# Altium schematic sheet Sheet2_USB-PD.SchDoc: =ProjectName
size A4; DocumentNumber: 2; SheetNumber: 2; SheetTotal: 4
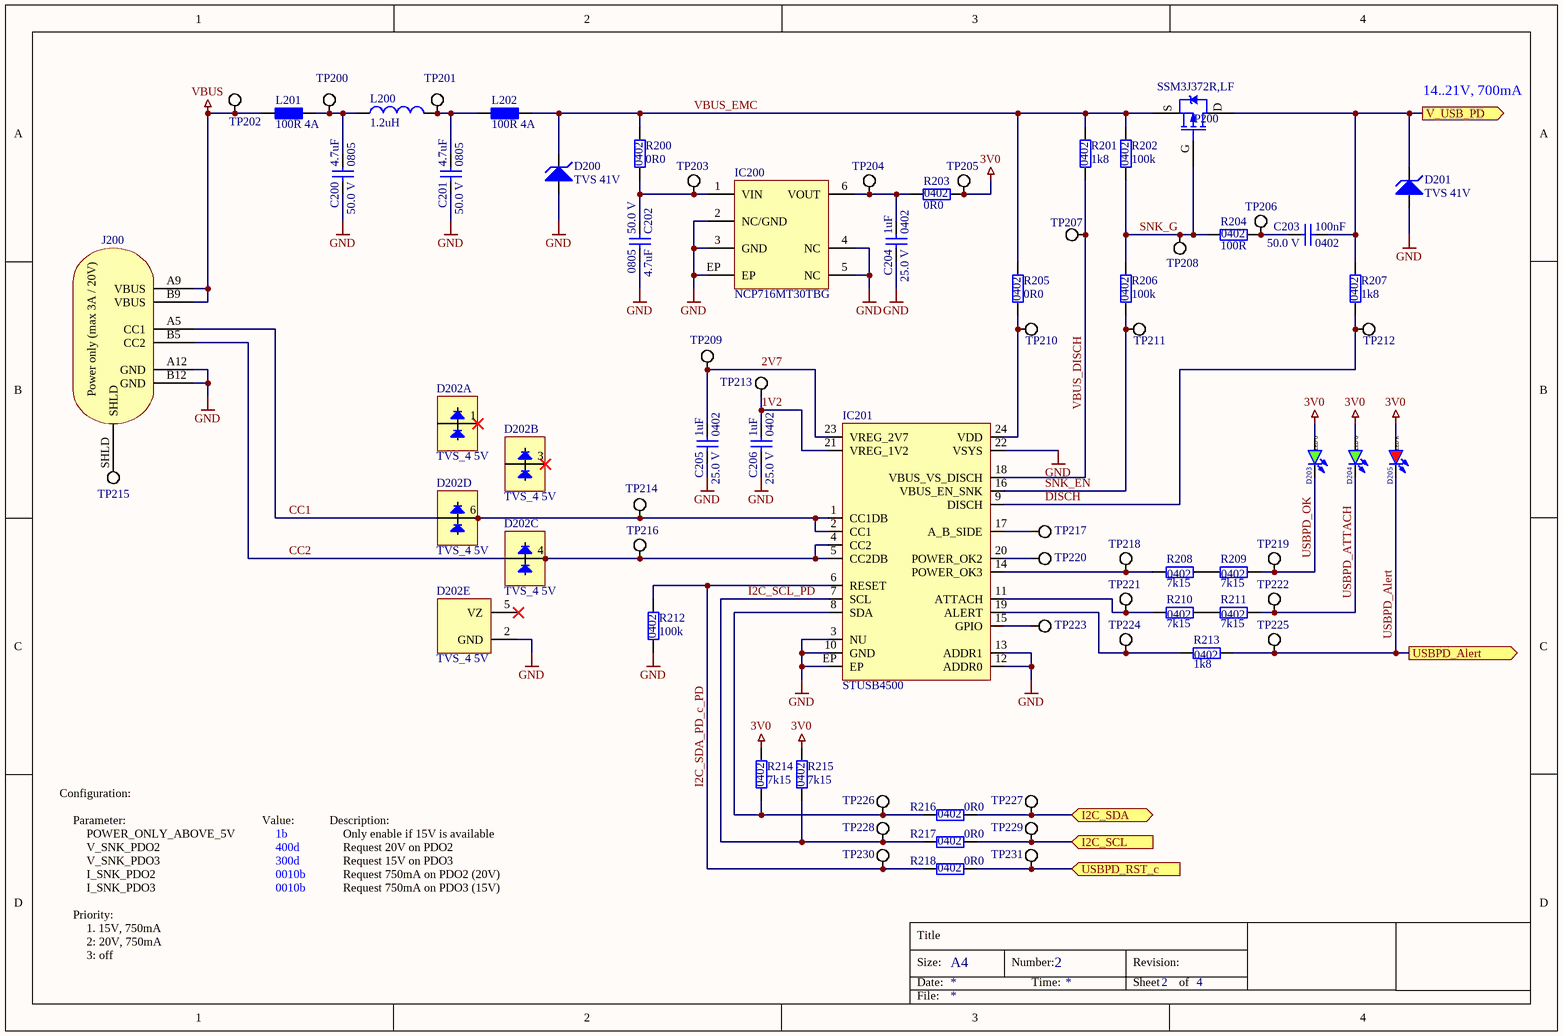
[diagram p0: Sheet2_USB-PD.SchDoc]

## Parts
C200  Capacitance: 4.7uF  Footprint: 0805  Voltage: 50.0 V  [C_0805]  (hidden comment: C 4.7uF 0805 50V)
C201  Capacitance: 4.7uF  Footprint: 0805  Voltage: 50.0 V  [C_0805]  (hidden comment: C 4.7uF 0805 50V)
C202  Capacitance: 4.7uF  Footprint: 0805  Voltage: 50.0 V  [C_0805]  (hidden comment: C 4.7uF 0805 50V)
C203  Capacitance: 100nF  Footprint: 0402  Voltage: 50.0 V  [C_0402]  (hidden comment: C 100nF 0402 50V)
C204  Capacitance: 1uF  Footprint: 0402  Voltage: 25.0 V  [C_0402]  (hidden comment: C 1uF 0402 25V)
C205  Capacitance: 1uF  Footprint: 0402  Voltage: 25.0 V  [C_0402]  (hidden comment: C 1uF 0402 25V)
C206  Capacitance: 1uF  Footprint: 0402  Voltage: 25.0 V  [C_0402]  (hidden comment: C 1uF 0402 25V)
D200  TVS 41V  [UDFN-2]
D201  TVS 41V  [UDFN-2]
D202  TVS_4 5V  [SOT-23-6]  (parts A,B,C,D,E of 5)
D203  LED G  [LED_0603]
D204  LED G  [LED_0603]
D205  LED R  [LED_0603]
IC200  NCP716MT30TBG  [WDFN-6_EP]
IC201  STUSB4500  [VFQFN-24]
J200  USB_C PWR  [J_TYPE-C-3_UJC-HP2-3]  (value not drawn)
L200  Inductance: 1.2uH  [L_3020]  (hidden comment: L 1.2uH 3.9A)
L201  Inductance: 100R 4A  [L_1206]  (hidden comment: L Ferrite 100R 4A)
L202  Inductance: 100R 4A  [L_1206]  (hidden comment: L Ferrite 100R 4A)
P200  Manufacturer Part Number: SSM3J372R,LF  [SOT-23-3-F]  (hidden comment: P PMOS 30V 6A)
R200  Resistance: 0R0  Footprint: 0402  [R_0402]  (hidden comment: R 0R0 0402)
R201  Resistance: 1k8  Footprint: 0402  [R_0402]  (hidden comment: R 1k8 0402)
R202  Resistance: 100k  Footprint: 0402  [R_0402]  (hidden comment: R 100k 0402)
R203  Resistance: 0R0  Footprint: 0402  [R_0402]  (hidden comment: R 0R0 0402)
R204  Resistance: 100R  Footprint: 0402  [R_0402]  (hidden comment: R 100R 0402)
R205  Resistance: 0R0  Footprint: 0402  [R_0402]  (hidden comment: R 0R0 0402)
R206  Resistance: 100k  Footprint: 0402  [R_0402]  (hidden comment: R 100k 0402)
R207  Resistance: 1k8  Footprint: 0402  [R_0402]  (hidden comment: R 1k8 0402)
R208  Resistance: 7k15  Footprint: 0402  [R_0402]  (hidden comment: R 7k15 0402)
R209  Resistance: 7k15  Footprint: 0402  [R_0402]  (hidden comment: R 7k15 0402)
R210  Resistance: 7k15  Footprint: 0402  [R_0402]  (hidden comment: R 7k15 0402)
R211  Resistance: 7k15  Footprint: 0402  [R_0402]  (hidden comment: R 7k15 0402)
R212  Resistance: 100k  Footprint: 0402  [R_0402]  (hidden comment: R 100k 0402)
R213  Resistance: 1k8  Footprint: 0402  [R_0402]  (hidden comment: R 1k8 0402)
R214  Resistance: 7k15  Footprint: 0402  [R_0402]  (hidden comment: R 7k15 0402)
R215  Resistance: 7k15  Footprint: 0402  [R_0402]  (hidden comment: R 7k15 0402)
R216  Resistance: 0R0  Footprint: 0402  [R_0402]  (hidden comment: R 0R0 0402)
R217  Resistance: 0R0  Footprint: 0402  [R_0402]  (hidden comment: R 0R0 0402)
R218  Resistance: 0R0  Footprint: 0402  [R_0402]  (hidden comment: R 0R0 0402)
TP200  TP  [TP_1mm]  (value not drawn)  (net tie, no BOM)
TP201  TP  [TP_1mm]  (value not drawn)  (net tie, no BOM)
TP202  TP  [TP_1mm]  (value not drawn)  (net tie, no BOM)
TP203  TP  [TP_1mm]  (value not drawn)  (net tie, no BOM)
TP204  TP  [TP_1mm]  (value not drawn)  (net tie, no BOM)
TP205  TP  [TP_1mm]  (value not drawn)  (net tie, no BOM)
TP206  TP  [TP_1mm]  (value not drawn)  (net tie, no BOM)
TP207  TP  [TP_1mm]  (value not drawn)  (net tie, no BOM)
TP208  TP  [TP_1mm]  (value not drawn)  (net tie, no BOM)
TP209  TP  [TP_1mm]  (value not drawn)  (net tie, no BOM)
TP210  TP  [TP_1mm]  (value not drawn)  (net tie, no BOM)
TP211  TP  [TP_1mm]  (value not drawn)  (net tie, no BOM)
TP212  TP  [TP_1mm]  (value not drawn)  (net tie, no BOM)
TP213  TP  [TP_1mm]  (value not drawn)  (net tie, no BOM)
TP214  TP  [TP_1mm]  (value not drawn)  (net tie, no BOM)
TP215  TP  [TP_1mm]  (value not drawn)  (net tie, no BOM)
TP216  TP  [TP_1mm]  (value not drawn)  (net tie, no BOM)
TP217  TP  [TP_1mm]  (value not drawn)  (net tie, no BOM)
TP218  TP  [TP_1mm]  (value not drawn)  (net tie, no BOM)
TP219  TP  [TP_1mm]  (value not drawn)  (net tie, no BOM)
TP220  TP  [TP_1mm]  (value not drawn)  (net tie, no BOM)
TP221  TP  [TP_1mm]  (value not drawn)  (net tie, no BOM)
TP222  TP  [TP_1mm]  (value not drawn)  (net tie, no BOM)
TP223  TP  [TP_1mm]  (value not drawn)  (net tie, no BOM)
TP224  TP  [TP_1mm]  (value not drawn)  (net tie, no BOM)
TP225  TP  [TP_1mm]  (value not drawn)  (net tie, no BOM)
TP226  TP  [TP_1mm]  (value not drawn)  (net tie, no BOM)
TP227  TP  [TP_1mm]  (value not drawn)  (net tie, no BOM)
TP228  TP  [TP_1mm]  (value not drawn)  (net tie, no BOM)
TP229  TP  [TP_1mm]  (value not drawn)  (net tie, no BOM)
TP230  TP  [TP_1mm]  (value not drawn)  (net tie, no BOM)
TP231  TP  [TP_1mm]  (value not drawn)  (net tie, no BOM)

## Ports
I2C_SCL (in), I2C_SDA (bidir), USBPD_Alert (out), USBPD_RST_c (in), V_USB_PD (out)

## Nets
3V0: D203.A D204.A D205.A R203.2 R214.2 R215.2 TP205.1(TP)
GND: C200.1 C201.1 C202.2 C204.1 C205.1 C206.1 D200.2(A) D201.2(A) D202.2(GND) IC200.2(NC/GND) IC200.3(GND) IC200.4(NC) IC200.5(NC) IC200.EP IC201.3(NU) IC201.10(GND) IC201.12(ADDR0) IC201.13(ADDR1) IC201.22(VSYS) IC201.EP J200.A12(GND) J200.B12(GND) R212.1
VBUS: J200.A9(VBUS) J200.B9(VBUS) L201.1 TP202.1(TP)
1V2: C206.2 IC201.21(VREG_1V2) TP213.1(TP)
2V7: C205.2 IC201.23(VREG_2V7) TP209.1(TP)
CC1: D202.6 IC201.1(CC1DB) IC201.2(CC1) J200.A5(CC1) TP214.1(TP)
CC2: D202.4 IC201.4(CC2) IC201.5(CC2DB) J200.B5(CC2) TP216.1(TP)
DISCH: IC201.9(DISCH) R207.1 TP212.1(TP)
I2C_SCL: R217.2 TP229.1(TP) ; port I2C_SCL
I2C_SCL_PD: IC201.7(SCL) R215.1 R217.1 TP228.1(TP)
I2C_SDA: R216.2 TP227.1(TP) ; port I2C_SDA
I2C_SDA_PD_c_PD: IC201.6(RESET) R212.2 R218.1 TP230.1(TP)
SNK_EN: IC201.16(VBUS_EN_SNK) R206.1 TP211.1(TP)
SNK_G: P200.1(G) R202.1 R204.1 R206.2 TP208.1(TP)
USBPD_Alert: D205.K R213.1 TP225.1(TP) ; port USBPD_Alert
USBPD_ATTACH: D204.K R211.1 TP222.1(TP)
USBPD_OK: D203.K R209.1 TP219.1(TP)
USBPD_RST_c: R218.2 TP231.1(TP) ; port USBPD_RST_c
V_USB_PD: C203.2 D201.1(K) P200.3(D) R207.2 ; port V_USB_PD
VBUS_DISCH: IC201.18(VBUS_VS_DISCH) R201.1 TP207.1(TP)
VBUS_EMC: D200.1(K) L202.2 P200.2(S) R200.2 R201.2 R202.2 R205.2
NetC200_2: C200.2 L200.1 L201.2 TP200.1(TP)
NetC201_2: C201.2 L200.2 L202.1 TP201.1(TP)
NetC202_1: C202.1 IC200.1(VIN) R200.1 TP203.1(TP)
NetC203_1: C203.1 R204.2 TP206.1(TP)
NetC204_2: C204.2 IC200.6(VOUT) R203.1 TP204.1(TP)
NetIC201_8: IC201.8(SDA) R214.1 R216.1 TP226.1(TP)
NetIC201_11: IC201.11(ATTACH) R210.2 TP221.1(TP)
NetIC201_14: IC201.14(POWER_OK3) R208.2 TP218.1(TP)
NetIC201_15: IC201.15(GPIO) TP223.1(TP)
NetIC201_17: IC201.17(A_B_SIDE) TP217.1(TP)
NetIC201_19: IC201.19(ALERT) R213.2 TP224.1(TP)
NetIC201_20: IC201.20(POWER_OK2) TP220.1(TP)
NetIC201_24: IC201.24(VDD) R205.1 TP210.1(TP)
NetJ200_SHLD: J200.SHLD TP215.1(TP)
NetR208_1: R208.1 R209.2
NetR210_1: R210.1 R211.2

Not connected (* = marked no-connect by the designer): D202 1* 3* 5(VZ)*

## Notes on the sheet
- 14..21V, 700mA
- Configuration:
- Parameter:
- POWER_ONLY_ABOVE_5V
- V_SNK_PDO2
- Value:
- 1b
- 400d
- Description:
- Only enable if 15V is available
- Request 20V on PDO2
- Priority:
- V_SNK_PDO3
- I_SNK_PDO2
- I_SNK_PDO3
- 300d
- 0010b
- Request 15V on PDO3
- Request 750mA on PDO2 (20V)
- Request 750mA on PDO3 (15V)
- 1. 15V, 750mA
- 2: 20V, 750mA
- 3: off
- Title
- Size:
- Date:
- A4
- Number:
- Time:
- Revision:
- Sheet
- of
- File:
- (in symbol J_USB-C_3) Power only (max 3A / 20V)

## Library data of the parts
C200-C202 = CAP_4.7uF_50V_0805: CAP CER 4.7UF 50V X5R 0805; Manufacturer: Samsung Electro-Mechanics; Manufacturer Part Number: CL21A475KBQNNNE; Type: Capacitor; Supplier 1: Digi-Key; Supplier Part Number 1: 1276-1248-1-ND
C203 = CAP_100nF_50V_0402: CAP CER 0.1UF 50V X7R 0402; Manufacturer: Murata Electronics; Manufacturer Part Number: GRM155R71H104KE14J; Type: Capacitor; Supplier 1: Digi-Key; Supplier Part Number 1: 490-13342-1-ND
C204-C206 = CAP_1uF_25V_0402: CAP CER 1UF 25V X5R 0402; Manufacturer: Taiyo Yuden; Manufacturer Part Number: TMK105BJ105MV-F; Type: Capacitor; Supplier 1: Digi-Key; Supplier Part Number 1: 587-3245-1-ND
D200 D201 = D_SCH_41V_35A: TVS DIODE 22VWM 41VC 1610; Manufacturer: STMicroelectronics; Manufacturer Part Number: ESDA25P35-1U1M; Type: Diode, TVS; Supplier 1: Digi-Key; Supplier Part Number 1: 497-16913-1-ND
D202 = D_TVS_U4_12V5: TVS DIODE 5VWM 12.5VC SOT23-6; Manufacturer: Comchip Technology; Manufacturer Part Number: CPDT6-5V0UPC-HF; Type: Diode, TVS; Supplier 1: Digi-Key; Supplier Part Number 1: 641-1829-1-ND
D203 D204 = D_LED_Green_0603: LED GREEN DIFFUSED 0603 SMD; Manufacturer: OSRAM Opto Semiconductors Inc.; Manufacturer Part Number: LT Q39G-Q1OO-25-1; Type: Diode, LED; Supplier 1: Digi-Key; Supplier Part Number 1: 475-3442-1-ND
D205 = D_LED_Red_0603: LED RED DIFFUSED 0603 SMD; Manufacturer: OSRAM Opto Semiconductors Inc.; Manufacturer Part Number: LS Q976-NR-1; Type: Diode, LED; Supplier 1: Digi-Key; Supplier Part Number 1: 475-2512-1-ND
IC200 = IC_Reg_NCP716MT30TBG: IC REG LINEAR 3V 80MA 6WDFN; Manufacturer: onsemi; Manufacturer Part Number: NCP716MT30TBG; Type: IC, Regulator; Supplier 1: Digi-Key; Supplier Part Number 1: 488-NCP716MT30TBGTR-ND
IC201 = IC_STUSB4500: IC USB CONTROLLER I2C 24QFN; Manufacturer: STMicroelectronics; Manufacturer Part Number: STUSB4500QTR; Type: IC; Supplier 1: Digi-Key; Supplier Part Number 1: 497-18060-2-ND
J200 = J_USB-C_3: TYPE C, 20 VDC, 3 A, RIGHT ANGLE; Manufacturer: CUI Devices; Manufacturer Part Number: UJC-HP2-3-SMT-TR; Type: Connector; Supplier 1: Digi-Key; Supplier Part Number 1: 2223-UJC-HP2-3-SMT-TR-ND; Pins: 6; Pitch: *
L200 = L_1.2uH_3.9A: FIXED IND 1.2UH 3.9A 36 MOHM SMD; Manufacturer: Würth Elektronik; Manufacturer Part Number: 74438336012; Type: Inductor; Supplier 1: Digi-Key; Supplier Part Number 1: 732-5694-1-ND
L201 L202 = L_100R_4A: FIXED IND 100 4000MA 1206; Manufacturer: Eaton - Electronics Division; Manufacturer Part Number: MFBM1V3216-101-R; Type: Inductor, Ferrite; Supplier 1: Digi-Key; Supplier Part Number 1: 283-MFBM1V3216-101-RCT-ND
P200 = P_PCH_30V_1W: MOSFET P-CH 30V 6A SOT23F; Manufacturer: Toshiba Semiconductor and Storage; Type: Transistor; Supplier 1: Digi-Key; Supplier Part Number 1: SSM3J372RLFCT-ND
R200 R203 R205 R216-R218 = R_0R0_0402: RES 0 OHM JUMPER 1/16W 0402; Manufacturer: Stackpole Electronics Inc; Manufacturer Part Number: RMCF0402ZT0R00; Type: Resistor; Supplier 1: Digi-Key; Supplier Part Number 1: RMCF0402ZT0R00CT-ND
R201 R207 R213 = R_1k8_0402: RES 1.8K OHM 1% 1/16W 0402; Manufacturer: Stackpole Electronics Inc; Manufacturer Part Number: RMCF0402FT1K80; Type: Resistor; Supplier 1: Digi-Key; Supplier Part Number 1: RMCF0402FT1K80CT-ND
R202 R206 R212 = R_100k_0402: RES 100K OHM 5% 1/16W 0402; Manufacturer: YAGEO; Manufacturer Part Number: RC0402JR-07100KL; Type: Resistor; Supplier 1: Digi-Key; Supplier Part Number 1: 311-100KJRCT-ND
R204 = R_100R_0402: RES 100 OHM 1% 1/16W 0402; Manufacturer: Stackpole Electronics Inc; Manufacturer Part Number: RMCF0402FT100R; Type: Resistor; Supplier 1: Digi-Key; Supplier Part Number 1: RMCF0402FT100RCT-ND
R208-R211 R214 R215 = R_7k15_0402: RES 7.15K OHM 1% 1/16W 0402; Manufacturer: Stackpole Electronics Inc; Manufacturer Part Number: RMCF0402FT7K15; Type: Resistor; Supplier 1: Digi-Key; Supplier Part Number 1: RMCF0402FT7K15CT-ND
TP200-TP231 = TP_1mm: Test Point 1mm